# Altium project STM32F103RB最小系统_RV2.PrjPcb
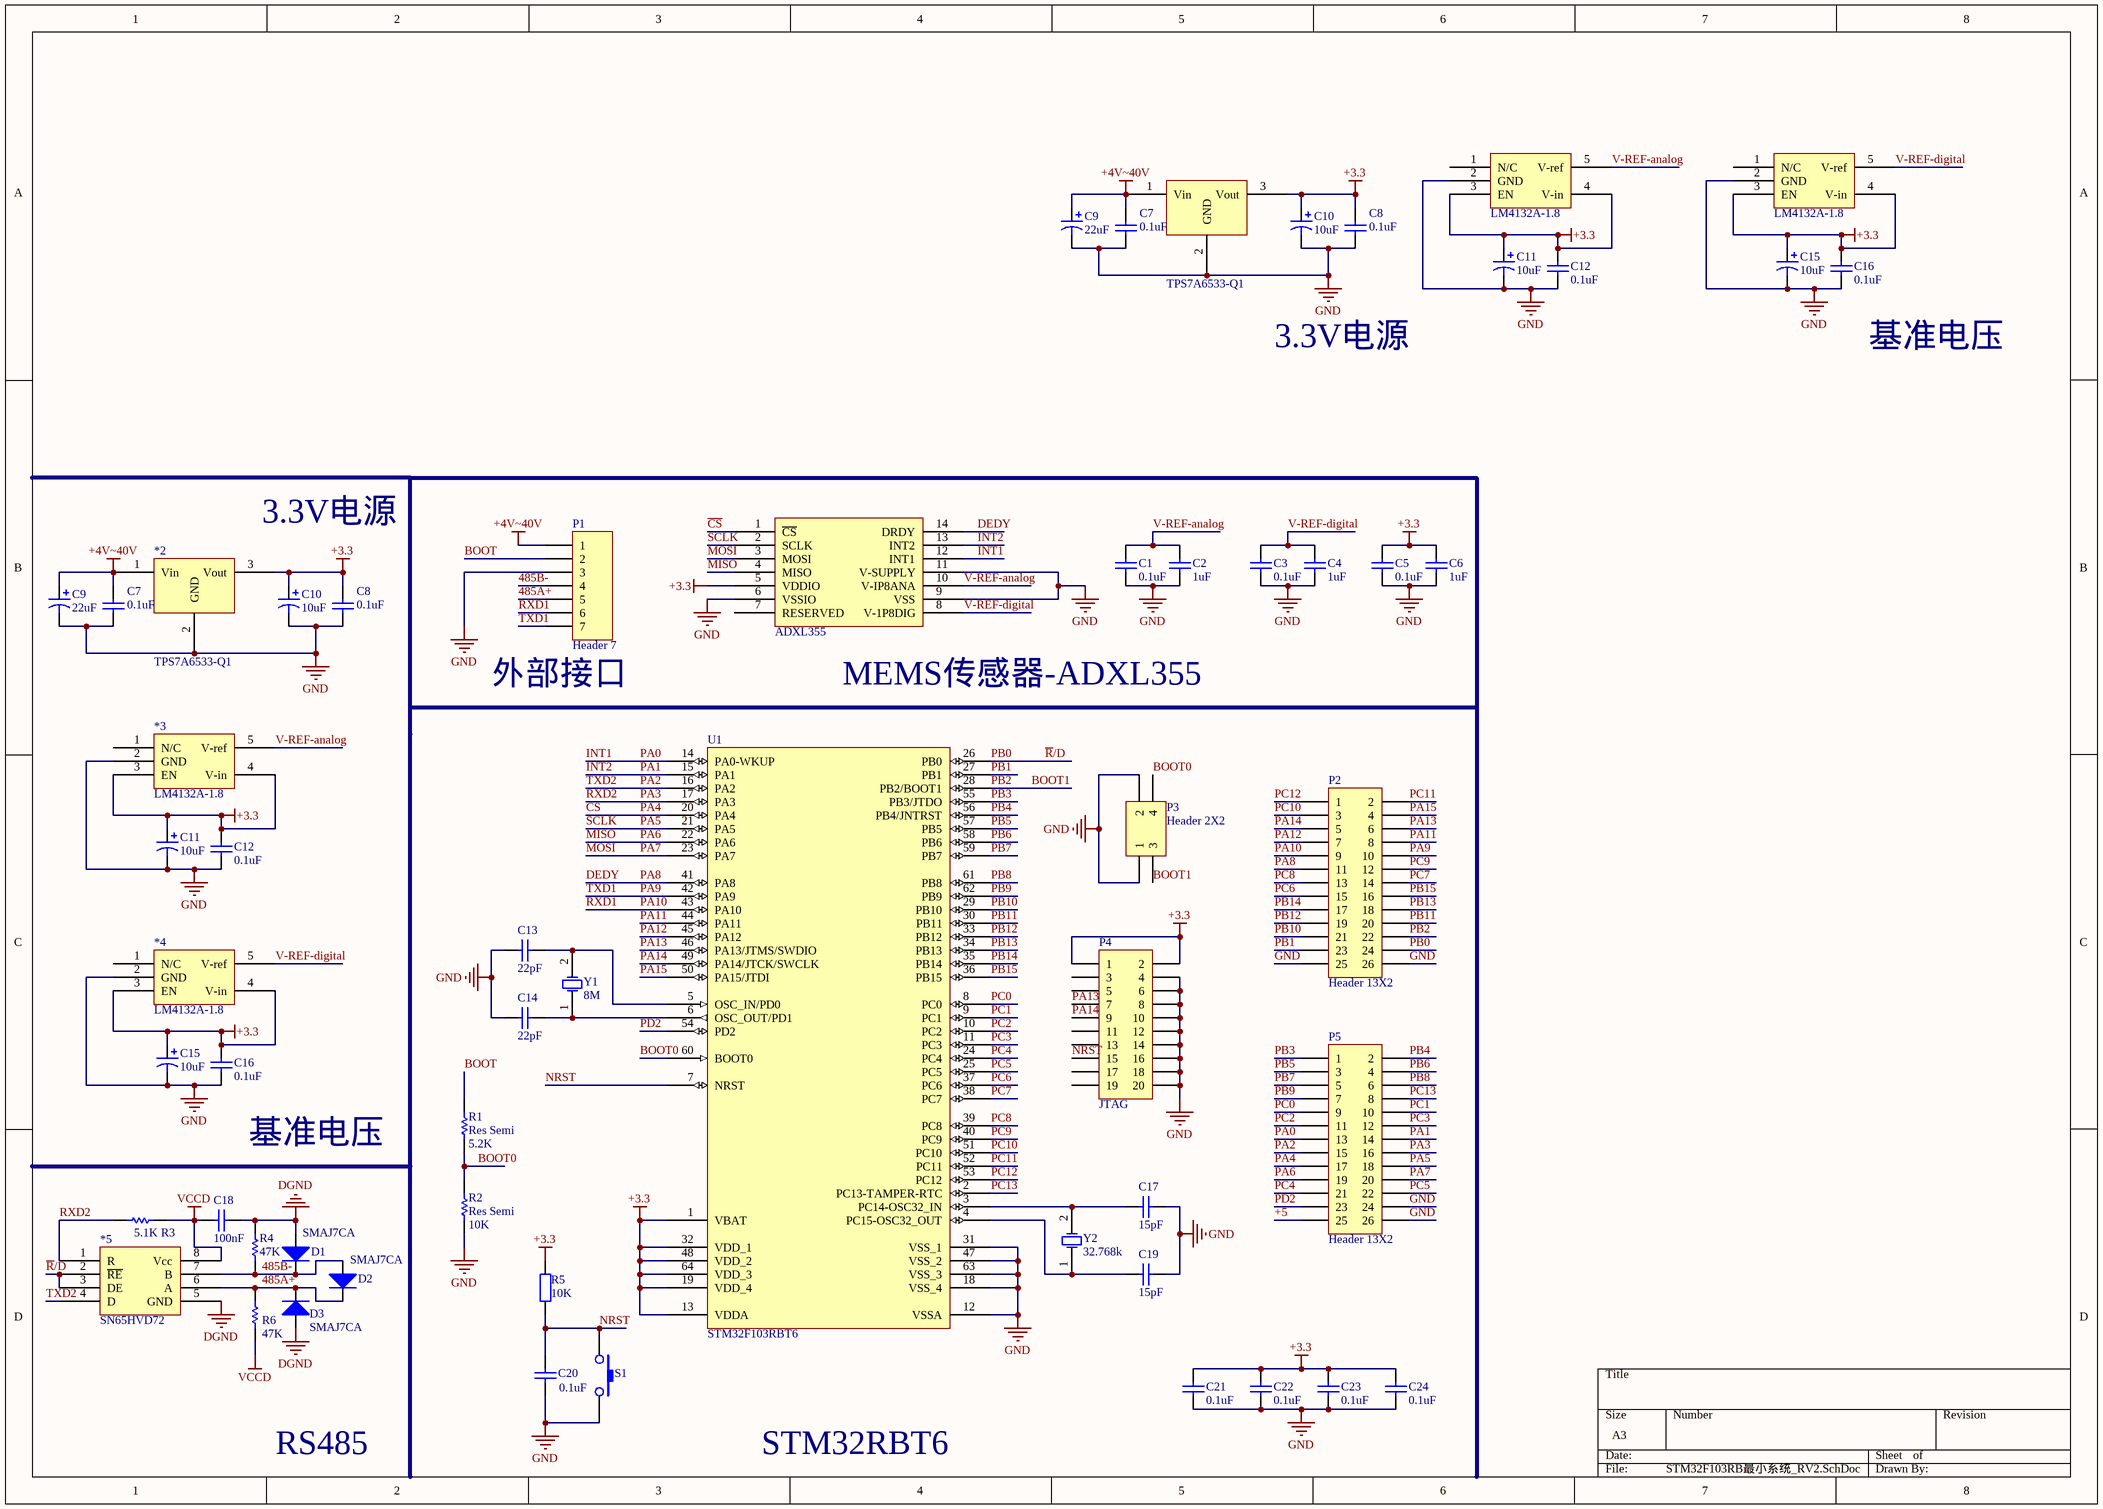
[diagram p0: STM32F103RB最小系统_RV2.SchDoc]
1 sheet, 58 parts. Net scope: global (net labels, ports and power ports of the same name join across sheets).
Board file: STM32F103RB最小系统_RV2.PcbDoc

## Sheet STM32F103RB最小系统_RV2.SchDoc
size A3; SheetNumber: 1

### Parts
(Parts that share a designator on the sheet are numbered #1, #2 ... from top to bottom, then left to right.)
*2  TPS7A6533-Q1
*3  LM4132A-1.8
*4  LM4132A-1.8
*5  SN65HVD72
?#1  LM4132A-1.8
?#2  LM4132A-1.8
?#3  TPS7A6533-Q1
?#4  ADXL355
C1  0.1uF  [0805C]
C2  1uF  [0805C]
C3  0.1uF  [0805C]
C4  1uF  [0805C]
C5  0.1uF  [0805C]
C6  1uF  [0805C]
C7#1  0.1uF  [0805C]
C7#2  0.1uF  [0805C]
C8#1  0.1uF  [0805C]
C8#2  0.1uF  [0805C]
C9#1  22uF  [0805C]
C9#2  22uF  [0805C]
C10#1  10uF  [0805C]
C10#2  10uF  [0805C]
C11#1  10uF  [0805C]
C11#2  10uF  [0805C]
C12#1  0.1uF  [0805C]
C12#2  0.1uF  [0805C]
C13  22pF  [0805C]
C14  22pF  [0805C]
C15#1  10uF  [0805C]
C15#2  10uF  [0805C]
C16#1  0.1uF  [0805C]
C16#2  0.1uF  [0805C]
C17  15pF  [0805C]
C18  100nF  [0603]
C19  15pF  [0805C]
C20  0.1uF  [0805C]
C21  0.1uF  [0805C]
C22  0.1uF  [0805C]
C23  0.1uF  [0805C]
C24  0.1uF  [0805C]
D1  SMAJ7CA  [D6526]
D2  SMAJ7CA  [D6526]
D3  SMAJ7CA  [D6526]
P1  Header 7  [HDR1X7]
P2  Header 13X2  [HDR2X13]
P3  Header 2X2  [HDR2X2]
P4  JTAG  [JTAG20]
P5  Header 13X2  [HDR2X13]
R1  Res Semi  value 5.2K  [0603P]
R2  Res Semi  value 10K  [0603P]
R3  5.1K  [0603]
R4  47K  [0603]
R5  10K  [0805R]
R6  47K  [0603]
S1  KEY  [KEY_SOP]  (value not drawn)
U1  STM32F103RBT6  [LQFP64_N]
Y1  8M  [OSC2PR-1]
Y2  32.768k  [XTAL-B]

### Nets
+3.3: *2.3(Vout) *3.3(EN) *3.4(V-in) *4.3(EN) *4.4(V-in) ?#1.3(EN) ?#1.4(V-in) ?#2.3(EN) ?#2.4(V-in) ?#3.3(Vout) ?#4.5(VDDIO) C5.1 C6.2 C8#1.2 C8#2.2 C10#1.1 C10#2.1 C11#1.1 C11#2.1 C12#1.2 C12#2.2 C15#1.1 C15#2.1 C16#1.2 C16#2.2 C21.1 C22.1 C23.1 C24.1 P4.1 P4.2 R5.2 U1.1(VBAT) U1.13(VDDA) U1.19(VDD_4) U1.32(VDD_1) U1.48(VDD_2) U1.64(VDD_3)
+4V~40V: *2.1(Vin) ?#3.1(Vin) C7#1.2 C7#2.2 C9#1.1 C9#2.1 P1.1
DGND: *5.5(GND) C18.1 D1.1(A) D3.1(A) R4.2
GND: *2.2(GND) *3.2(GND) *4.2(GND) ?#1.2(GND) ?#2.2(GND) ?#3.2(GND) ?#4.6(VSSIO) ?#4.9(VSS) ?#4.11(V-SUPPLY) C1.2 C2.1 C3.2 C4.1 C5.2 C6.1 C7#1.1 C7#2.1 C8#1.1 C8#2.1 C9#1.2 C9#2.2 C10#1.2 C10#2.2 C11#1.2 C11#2.2 C12#1.1 C12#2.1 C13.1 C14.1 C15#1.2 C15#2.2 C16#1.1 C16#2.1 C17.2 C19.2 C20.1 C21.2 C22.2 C23.2 C24.2 P1.3 P2.25 P2.26 P3.1 P3.2 P4.4 P4.6 P4.8 P4.10 P4.12 P4.14 P4.16 P4.18 P4.20 P5.24 P5.26 R2.2 S1.2 U1.12(VSSA) U1.18(VSS_4) U1.31(VSS_1) U1.47(VSS_2) U1.63(VSS_3)
VCCD: *5.8(Vcc) C18.2 R3.1 R6.1
485A+: *5.6(A) D2.2(K) D3.2(K) P1.5 R6.2
485B-: *5.7(B) D1.2(K) D2.1(A) P1.4 R4.1
+5: P5.25
BOOT: P1.2 R1.1
BOOT0: P3.4 R1.2 R2.1 U1.60(BOOT0)
BOOT1: P2.22 P3.3 U1.28(PB2/BOOT1)  [also labelled PB2]
~{CS}: ?#4.1(~{CS}) P5.17 U1.20(PA4)  [also labelled PA4]
DEDY: ?#4.14(DRDY) P2.11 U1.41(PA8)  [also labelled PA8]
INT1: ?#4.12(INT1) P5.13 U1.14(PA0-WKUP)  [also labelled PA0]
INT2: ?#4.13(INT2) P5.14 U1.15(PA1)  [also labelled PA1]
MISO: ?#4.4(MISO) P5.19 U1.22(PA6)  [also labelled PA6]
MOSI: ?#4.3(MOSI) P5.20 U1.23(PA7)  [also labelled PA7]
NRST: C20.2 P4.15 R5.1 S1.1 U1.7(NRST)
PA2: *5.4(D) P5.15 U1.16(PA2)  [also labelled TXD2]
PA3: *5.1(R) P5.16 R3.2 U1.17(PA3)  [also labelled RXD2]
PA5: ?#4.2(SCLK) P5.18 U1.21(PA5)  [also labelled SCLK]
PA9: P1.7 P2.10 U1.42(PA9)  [also labelled TXD1]
PA10: P1.6 P2.9 U1.43(PA10)  [also labelled RXD1]
PA11: P2.8 U1.44(PA11)
PA12: P2.7 U1.45(PA12)
PA13: P2.6 P4.7 U1.46(PA13/JTMS/SWDIO)
PA14: P2.5 P4.9 U1.49(PA14/JTCK/SWCLK)
PA15: P2.4 U1.50(PA15/JTDI)
PB0: *5.2(~{RE}) *5.3(DE) P2.24 U1.26(PB0)  [also labelled ~{R}/D]
PB1: P2.23 U1.27(PB1)
PB3: P5.1 U1.55(PB3/JTDO)
PB4: P5.2 U1.56(PB4/JNTRST)
PB5: P5.3 U1.57(PB5)
PB6: P5.4 U1.58(PB6)
PB7: P5.5 U1.59(PB7)
PB8: P5.6 U1.61(PB8)
PB9: P5.7 U1.62(PB9)
PB10: P2.21 U1.29(PB10)
PB11: P2.20 U1.30(PB11)
PB12: P2.19 U1.33(PB12)
PB13: P2.18 U1.34(PB13)
PB14: P2.17 U1.35(PB14)
PB15: P2.16 U1.36(PB15)
PC0: P5.9 U1.8(PC0)
PC1: P5.10 U1.9(PC1)
PC2: P5.11 U1.10(PC2)
PC3: P5.12 U1.11(PC3)
PC4: P5.21 U1.24(PC4)
PC5: P5.22 U1.25(PC5)
PC6: P2.15 U1.37(PC6)
PC7: P2.14 U1.38(PC7)
PC8: P2.13 U1.39(PC8)
PC9: P2.12 U1.40(PC9)
PC10: P2.3 U1.51(PC10)
PC11: P2.2 U1.52(PC11)
PC12: P2.1 U1.53(PC12)
PC13: P5.8 U1.2(PC13-TAMPER-RTC)
PD2: P5.23 U1.54(PD2)
V-REF-analog: *3.5(V-ref) ?#1.5(V-ref) ?#4.10(V-IP8ANA) C1.1 C2.2
V-REF-digital: *4.5(V-ref) ?#2.5(V-ref) ?#4.8(V-1P8DIG) C3.1 C4.2
NetC13_2: C13.2 U1.5(OSC_IN/PD0) Y1.2(OSC2)
NetC14_2: C14.2 U1.6(OSC_OUT/PD1) Y1.1(OSC1)
NetC17_1: C17.1 U1.3(PC14-OSC32_IN) Y2.2(OSC2)
NetC19_1: C19.1 U1.4(PC15-OSC32_OUT) Y2.1(OSC1)

Not connected (* = marked no-connect by the designer): *3 1(N/C); *4 1(N/C); ?#1 1(N/C); ?#2 1(N/C); ?#4 7(RESERVED); P4 3 5 11 13 17 19

### Notes on the sheet
- 3.3V电源
- (near C16#1) 基准电压
- (near P1) 外部接口
- MEMS传感器-ADXL355
- 基准电压
- RS485
- STM32RBT6

### Library data of the parts
C1 C3 C5 C7#1 C7#2 C8#1 C8#2 C12#1 C12#2 C13 C14 C16#1 C16#2 C17-C24 = Cap: Capacitor; Published: 8-Jun-2000; LatestRevisionDate: 17-Jul-2002; LatestRevisionNote: Re-released for DXP Platform.; PackageReference: RAD-0.3; Publisher: Altium Limited
  C1 C3 C5 C7#1 C7#2 C8#1 C8#2 C12#1 C12#2 C16#1 C16#2 C20-C24: Value: 0.1uF
  C13 C14: Value: 22pF
  C17 C19: Value: 15pF
C2 C4 C6 = Cap: Capacitor; Value: 0.1uF; Published: 8-Jun-2000; LatestRevisionDate: 17-Jul-2002; LatestRevisionNote: Re-released for DXP Platform.; PackageReference: RAD-0.3; Publisher: Altium Limited
C9#1 C9#2 = Cap Pol1: Polarized Capacitor (Radial); Value: 10uF; Published: 8-Jun-2000; LatestRevisionDate: 17-Jul-2002; LatestRevisionNote: Re-released for DXP Platform.; PackageReference: RB7.6-15; Publisher: Altium Limited
C10#1 C10#2 C11#1 C11#2 C15#1 C15#2 = Cap Pol1: Polarized Capacitor (Radial); Published: 8-Jun-2000; LatestRevisionDate: 17-Jul-2002; LatestRevisionNote: Re-released for DXP Platform.; PackageReference: RB7.6-15; Publisher: Altium Limited; Value: 10uF
D1-D3 = SS16
P1 = Header 7: Header, 7-Pin; LatestRevisionDate: 17-Jul-2002; LatestRevisionNote: Re-released for DXP Platform.; Publisher: Altium Limited
P2 P5 = Header 13X2: Header, 13-Pin, Dual row; LatestRevisionDate: 17-Jul-2002; LatestRevisionNote: Re-released for DXP Platform.; Publisher: Altium Limited
P3 = Header 2X2: Header, 2-Pin, Dual row; LatestRevisionDate: 17-Jul-2002; LatestRevisionNote: Re-released for DXP Platform.; Publisher: Altium Limited
P4 = Header 10X2: Header, 10-Pin, Dual row; LatestRevisionDate: 17-Jul-2002; LatestRevisionNote: Re-released for DXP Platform.; Publisher: Altium Limited
R1 R2 = Res Semi: Resistor; Published: 8-Jun-2000; LatestRevisionDate: 17-Jul-2002; LatestRevisionNote: Re-released for DXP Platform.; PackageReference: AXIAL-0.5; Publisher: Altium Limited
R3 = Res1: Resistor; Published: 8-Jun-2000; LatestRevisionDate: 17-Jul-2002; LatestRevisionNote: Re-released for DXP Platform.; PackageReference: AXIAL-0.3; Publisher: Altium Limited
R4 R6 = RES
R5 = Res2: Resistor; Published: 8-Jun-2000; LatestRevisionDate: 17-Jul-2002; LatestRevisionNote: Re-released for DXP Platform.; PackageReference: AXIAL-0.4; Publisher: Altium Limited; Value: 10K
U1 = STM32F103RBT6: STM32 ARM-based 32-bit MCU with 128 Kbytes Flash, 64-pin LQFP, Industrial Temperature; Published: 30-May-2008; DatasheetVersion: rev6, Mar-2008; PackageVersion: Mar-2008; PackageReference: LQFP64; Publisher: Altium Limited; PackageDescription: 64-Pin Low-Profile Quad Flat Pack, 10 x 10 mm Body, 0.5 mm Pitch (LQFP64); ComponentLink1Description: Manufacturer Link; ComponentLink1URL: www.st.com/stm32; ComponentLink2Description: Datasheet; ComponentLink2URL: http://www.st.com/stonline/products/literature/ds/13587.pdf
Y1 Y2 = XTAL: Crystal Oscillator; Published: 8-Jun-2000; LatestRevisionDate: 17-Jul-2002; LatestRevisionNote: Re-released for DXP Platform.; PackageReference: R38; Publisher: Altium Limited